# Altium schematic sheet Leds.SchDoc
size A
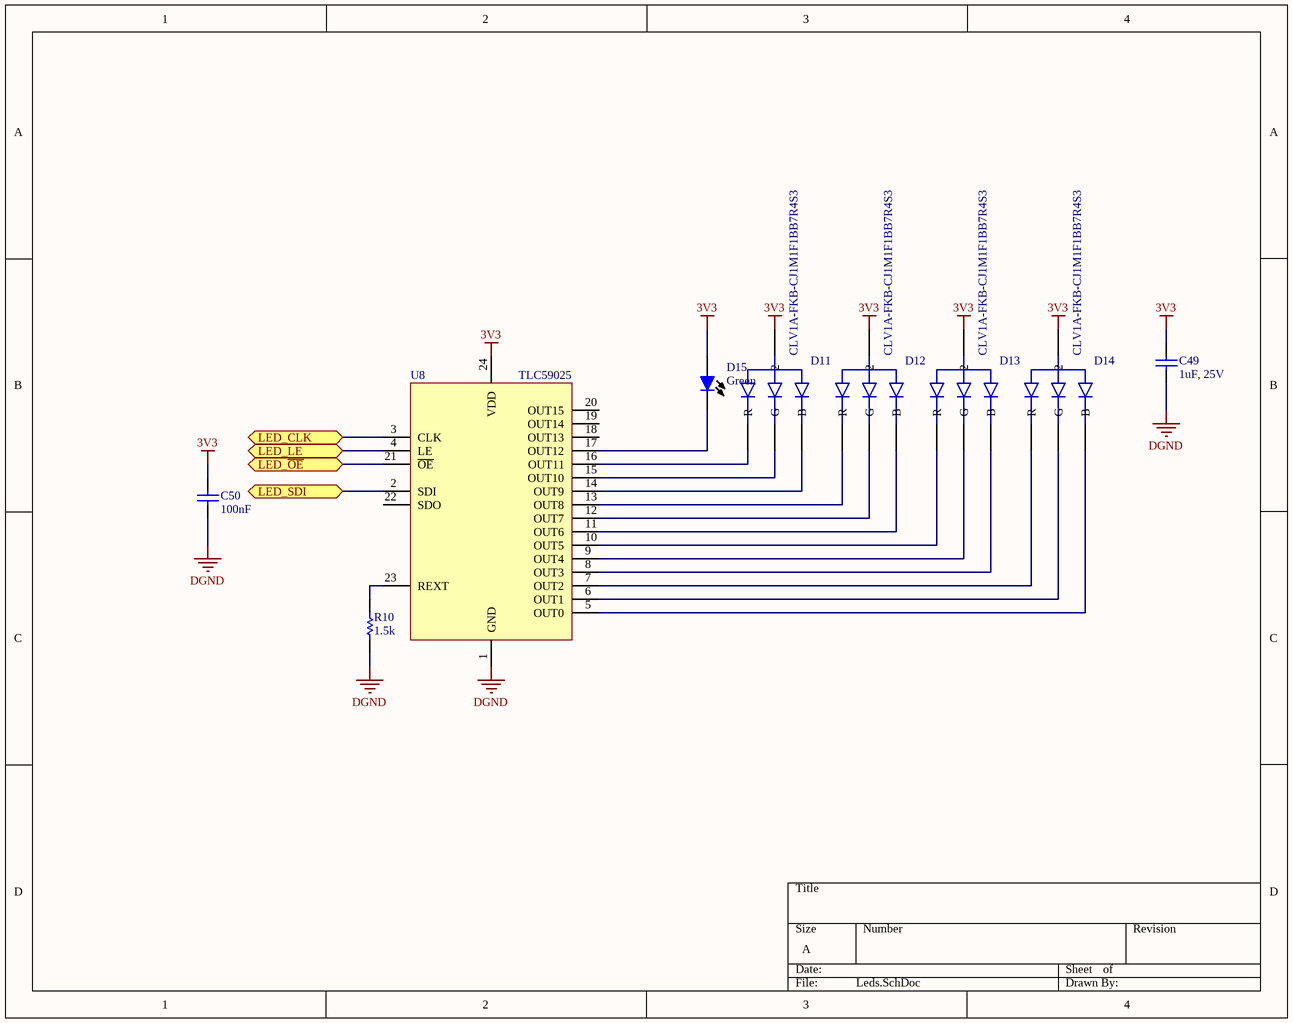
[diagram p0: Leds.SchDoc]

## Parts
C49  1uF, 25V  [CAPC1608L]
C50  100nF  [CAPC1608L]
D11  CLV1A-FKB-CJ1M1F1BB7R4S3  [RGB_LED_PLCC4]
D12  CLV1A-FKB-CJ1M1F1BB7R4S3  [RGB_LED_PLCC4]
D13  CLV1A-FKB-CJ1M1F1BB7R4S3  [RGB_LED_PLCC4]
D14  CLV1A-FKB-CJ1M1F1BB7R4S3  [RGB_LED_PLCC4]
D15  Color: Green  [CD1608-0603]  (hidden comment: LED Green)
R10  1.5k  [RESC1608L]
U8  TLC59025  [SOP24]

## Ports
LED_CLK, LED_LE, LED_SDI, LED_~{OE}

## Nets
3V3: C49.2 C50.2 D11.2 D12.2 D13.2 D14.2 D15.1(A) U8.24(VDD)
DGND: C49.1 C50.1 R10.1 U8.1(GND)
LED_CLK: U8.3(CLK) ; port LED_CLK
LED_LE: U8.4(LE) ; port LED_LE
LED_~{OE}: U8.21(~{OE}) ; port LED_~{OE}
LED_SDI: U8.2(SDI) ; port LED_SDI
NetD11_1: D11.1(R) U8.16(OUT11)
NetD11_3: D11.3(B) U8.14(OUT9)
NetD11_4: D11.4(G) U8.15(OUT10)
NetD12_1: D12.1(R) U8.13(OUT8)
NetD12_3: D12.3(B) U8.11(OUT6)
NetD12_4: D12.4(G) U8.12(OUT7)
NetD13_1: D13.1(R) U8.10(OUT5)
NetD13_3: D13.3(B) U8.8(OUT3)
NetD13_4: D13.4(G) U8.9(OUT4)
NetD14_1: D14.1(R) U8.7(OUT2)
NetD14_3: D14.3(B) U8.5(OUT0)
NetD14_4: D14.4(G) U8.6(OUT1)
NetD15_2: D15.2(C) U8.17(OUT12)
NetR10_2: R10.2 U8.23(REXT)

Not connected (* = marked no-connect by the designer): U8 18(OUT13) 19(OUT14) 20(OUT15) 22(SDO)

## Library data of the parts
C49 C50 = Cap Semi: Capacitor (Semiconductor SIM Model); Published: 8-Jun-2000; LatestRevisionDate: 29-May-2009; LatestRevisionNote: IPC-7351 Footprint Added.; PackageReference: C1206; Publisher: Altium Limited; PackageDescription: Chip Capacitor
  C49: Value: 1uF, 25V
  C50: Value: 100nF
D11-D14 = RGB_LED_COMMON_ANODE
D15 = LED
R10 = Res Semi: Semiconductor Resistor; Published: 8-Jun-2000; LatestRevisionDate: 17-Jul-2002; LatestRevisionNote: Re-released for DXP Platform.; PackageReference: AXIAL-0.5; Publisher: Altium Limited; Value: 1.5k